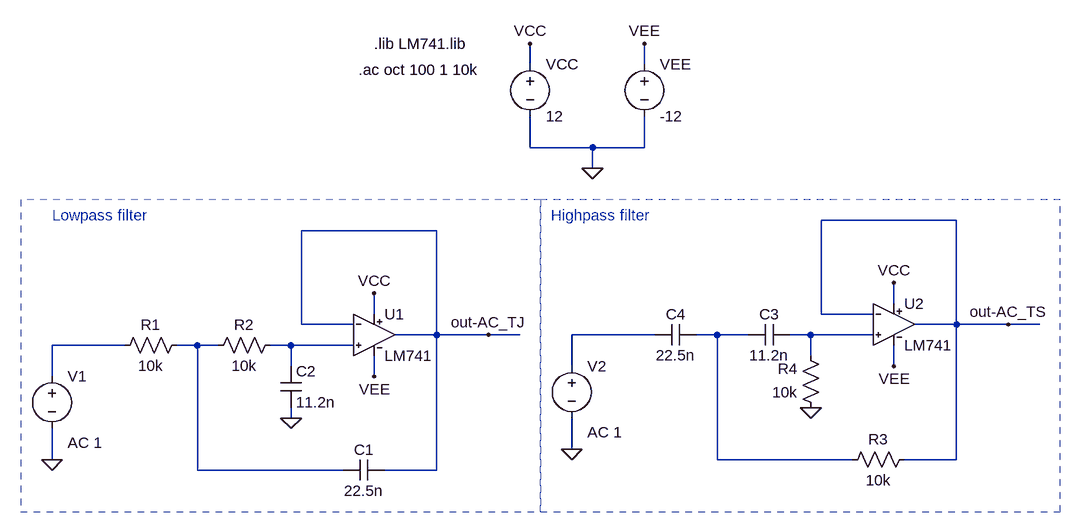
[diagram p0: schematic Filtre_Sallen_Key.asc]
Filtre_Sallen_Key.asc, the LTspice schematic file:
Version 4
SHEET 1 2144 1120
WIRE 1136 -144 1136 -176
WIRE 1312 -144 1312 -176
WIRE 1136 -16 1136 -64
WIRE 1232 -16 1136 -16
WIRE 1312 -16 1312 -64
WIRE 1312 -16 1232 -16
WIRE 1232 16 1232 -16
WIRE 1792 96 1584 96
WIRE 992 112 784 112
WIRE 1696 224 1696 192
WIRE 896 240 896 208
WIRE 1584 240 1584 96
WIRE 1664 240 1584 240
WIRE 784 256 784 112
WIRE 864 256 784 256
WIRE 1792 256 1792 96
WIRE 1792 256 1728 256
WIRE 1872 256 1792 256
WIRE 1920 256 1872 256
WIRE 992 272 992 112
WIRE 992 272 928 272
WIRE 1072 272 992 272
WIRE 1120 272 1072 272
WIRE 1328 272 1200 272
WIRE 1424 272 1392 272
WIRE 1472 272 1424 272
WIRE 1568 272 1536 272
WIRE 1664 272 1568 272
WIRE 512 288 400 288
WIRE 624 288 592 288
WIRE 656 288 624 288
WIRE 768 288 736 288
WIRE 864 288 768 288
WIRE 1568 304 1568 272
WIRE 768 320 768 288
WIRE 1200 320 1200 272
WIRE 1696 320 1696 288
WIRE 400 336 400 288
WIRE 896 336 896 304
WIRE 768 400 768 384
WIRE 1200 448 1200 400
WIRE 400 464 400 416
WIRE 1424 464 1424 272
WIRE 1632 464 1424 464
WIRE 1792 464 1792 256
WIRE 1792 464 1712 464
WIRE 624 480 624 288
WIRE 848 480 624 480
WIRE 992 480 992 272
WIRE 992 480 912 480
FLAG 896 336 VEE
FLAG 896 208 VCC
FLAG 1232 16 0
FLAG 1136 -176 VCC
FLAG 1312 -176 VEE
FLAG 400 464 0
FLAG 1072 272 out-AC_TJ
FLAG 768 400 0
FLAG 1696 320 VEE
FLAG 1696 192 VCC
FLAG 1200 448 0
FLAG 1872 256 out-AC_TS
FLAG 1568 384 0
SYMBOL LM741 896 208 R0
SYMATTR InstName U1
SYMBOL voltage 1136 -160 R0
WINDOW 123 0 0 Left 2
WINDOW 39 0 0 Left 2
SYMATTR InstName VCC
SYMATTR Value 12
SYMBOL voltage 1312 -160 R0
WINDOW 123 0 0 Left 2
WINDOW 39 0 0 Left 2
SYMATTR InstName VEE
SYMATTR Value -12
SYMBOL voltage 400 320 R0
WINDOW 123 24 118 Left 2
WINDOW 39 0 0 Left 2
SYMATTR Value2 AC 1
SYMATTR InstName V1
SYMATTR Value ""
SYMBOL res 608 272 R90
WINDOW 0 0 56 VBottom 2
WINDOW 3 32 56 VTop 2
SYMATTR InstName R1
SYMATTR Value 10k
SYMBOL res 752 272 R90
WINDOW 0 0 56 VBottom 2
WINDOW 3 32 56 VTop 2
SYMATTR InstName R2
SYMATTR Value 10k
SYMBOL cap 752 320 R0
SYMATTR InstName C2
SYMATTR Value 11.2n
SYMBOL cap 912 464 R90
WINDOW 0 0 32 VBottom 2
WINDOW 3 32 32 VTop 2
SYMATTR InstName C1
SYMATTR Value 22.5n
SYMBOL LM741 1696 192 R0
SYMATTR InstName U2
SYMBOL voltage 1200 304 R0
WINDOW 123 24 118 Left 2
WINDOW 39 0 0 Left 2
SYMATTR Value2 AC 1
SYMATTR InstName V2
SYMATTR Value ""
SYMBOL res 1728 448 R90
WINDOW 0 0 56 VBottom 2
WINDOW 3 32 56 VTop 2
SYMATTR InstName R3
SYMATTR Value 10k
SYMBOL res 1584 400 R180
WINDOW 0 36 76 Left 2
WINDOW 3 36 40 Left 2
SYMATTR InstName R4
SYMATTR Value 10k
SYMBOL cap 1536 256 R90
WINDOW 0 0 32 VBottom 2
WINDOW 3 32 32 VTop 2
SYMATTR InstName C3
SYMATTR Value 11.2n
SYMBOL cap 1392 256 R90
WINDOW 0 0 32 VBottom 2
WINDOW 3 32 32 VTop 2
SYMATTR InstName C4
SYMATTR Value 22.5n
TEXT 896 -176 Left 2 !.lib LM741.lib
TEXT 872 -136 Left 2 !.ac oct 100 1 10k
TEXT 400 88 Left 2 ;Lowpass filter
TEXT 1168 88 Left 2 ;Highpass filter
RECTANGLE Normal 1152 64 352 544 2
RECTANGLE Normal 1952 64 1152 544 2

The netlist it stands for:
* Filtre_Sallen_Key.asc
XU1 N006 out-AC_TJ VCC VEE out-AC_TJ LM741  ; pins In+ In- V+ V- OUT
VCC VCC 0 12
VEE VEE 0 -12
V1 N004 0 AC 1
R1 N005 N004 10k
R2 N006 N005 10k
C2 N006 0 11.2n
C1 out-AC_TJ N005 22.5n
XU2 N003 out-AC_TS VCC VEE out-AC_TS LM741  ; pins In+ In- V+ V- OUT
V2 N001 0 AC 1
R3 out-AC_TS N002 10k
R4 0 N003 10k
C3 N003 N002 11.2n
C4 N002 N001 22.5n
.lib LM741.lib
.ac oct 100 1 10k
* Lowpass filter
* Highpass filter
.lib LM741.lib
.backanno
.end